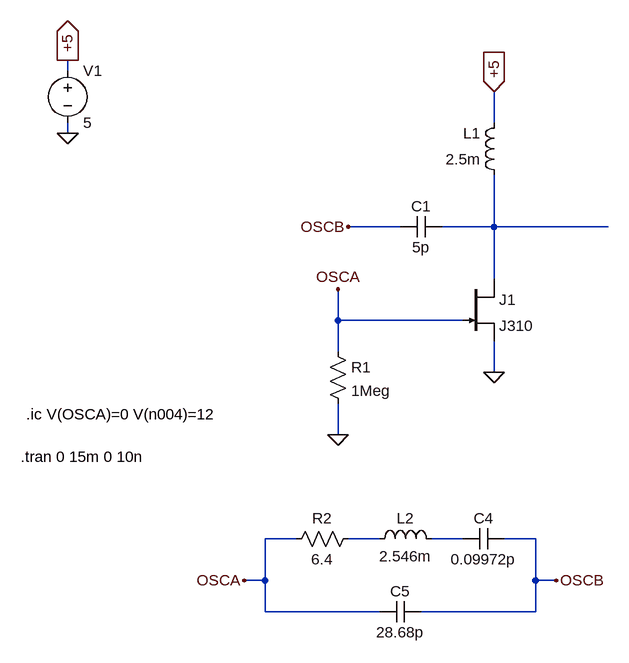
[diagram p0: schematic Analog_PLL.asc]
Analog_PLL.asc, the LTspice schematic file:
Version 4
SHEET 1 880 680
WIRE -400 -256 -400 -272
WIRE 256 -176 256 -224
WIRE -400 -160 -400 -176
WIRE 112 -16 32 -16
WIRE 256 -16 256 -96
WIRE 256 -16 176 -16
WIRE 432 -16 256 -16
WIRE 256 64 256 -16
WIRE 16 128 16 80
WIRE 208 128 16 128
WIRE 16 176 16 128
WIRE 256 208 256 160
WIRE 16 304 16 256
WIRE -48 464 -96 464
WIRE 80 464 32 464
WIRE 208 464 160 464
WIRE 320 464 272 464
WIRE -96 528 -96 464
WIRE -96 528 -128 528
WIRE 320 528 320 464
WIRE 352 528 320 528
WIRE -96 576 -96 528
WIRE 80 576 -96 576
WIRE 320 576 320 528
WIRE 320 576 144 576
FLAG -128 528 OSCA
FLAG 352 528 OSCB
FLAG 16 80 OSCA
FLAG 32 -16 OSCB
FLAG -400 -160 0
FLAG 256 -224 +5
IOPIN 256 -224 In
FLAG -400 -272 +5
IOPIN -400 -272 Out
FLAG 16 304 0
FLAG 256 208 0
SYMBOL njf 208 64 R0
SYMATTR InstName J1
SYMATTR Value J310
SYMBOL res 0 160 R0
SYMATTR InstName R1
SYMATTR Value 1Meg
SYMBOL res 48 448 R90
WINDOW 0 0 56 VBottom 2
WINDOW 3 32 56 VTop 2
SYMATTR InstName R2
SYMATTR Value 6.4
SYMBOL cap 272 448 R90
WINDOW 0 0 32 VBottom 2
WINDOW 3 32 32 VTop 2
SYMATTR InstName C4
SYMATTR Value 0.09972p
SYMBOL ind 64 480 R270
WINDOW 0 32 56 VTop 2
WINDOW 3 5 56 VBottom 2
SYMATTR InstName L2
SYMATTR Value 2.546m
SYMBOL cap 144 560 R90
WINDOW 0 0 32 VBottom 2
WINDOW 3 32 32 VTop 2
SYMATTR InstName C5
SYMATTR Value 28.68p
SYMBOL voltage -400 -272 R0
WINDOW 123 0 0 Left 0
WINDOW 39 0 0 Left 0
SYMATTR InstName V1
SYMATTR Value 5
SYMBOL cap 176 -32 R90
WINDOW 0 0 32 VBottom 2
WINDOW 3 32 32 VTop 2
SYMATTR InstName C1
SYMATTR Value 5p
SYMBOL ind 272 -80 R180
WINDOW 0 36 80 Left 2
WINDOW 3 36 40 Left 2
SYMATTR InstName L1
SYMATTR Value 2.5m
TEXT -472 338 Left 2 !.tran 0 15m 0 10n
TEXT -464 272 Left 2 !.ic V(OSCA)=0 V(n004)=12

The netlist it stands for:
* Analog_PLL.asc
J1 N001 OSCA 0 J310
R1 OSCA 0 1Meg
R2 N002 OSCA 6.4
C4 OSCB N003 0.09972p
L2 N002 N003 2.546m
C5 OSCB OSCA 28.68p
V1 +5 0 5
C1 N001 OSCB 5p
L1 N001 +5 2.5m
.model NJF NJF
.model PJF PJF
.lib standard.jft
.tran 0 15m 0 10n
.ic V(OSCA)=0 V(n004)=12
.backanno
.end